# Altium schematic sheet Sheet1.SchDoc
size A4
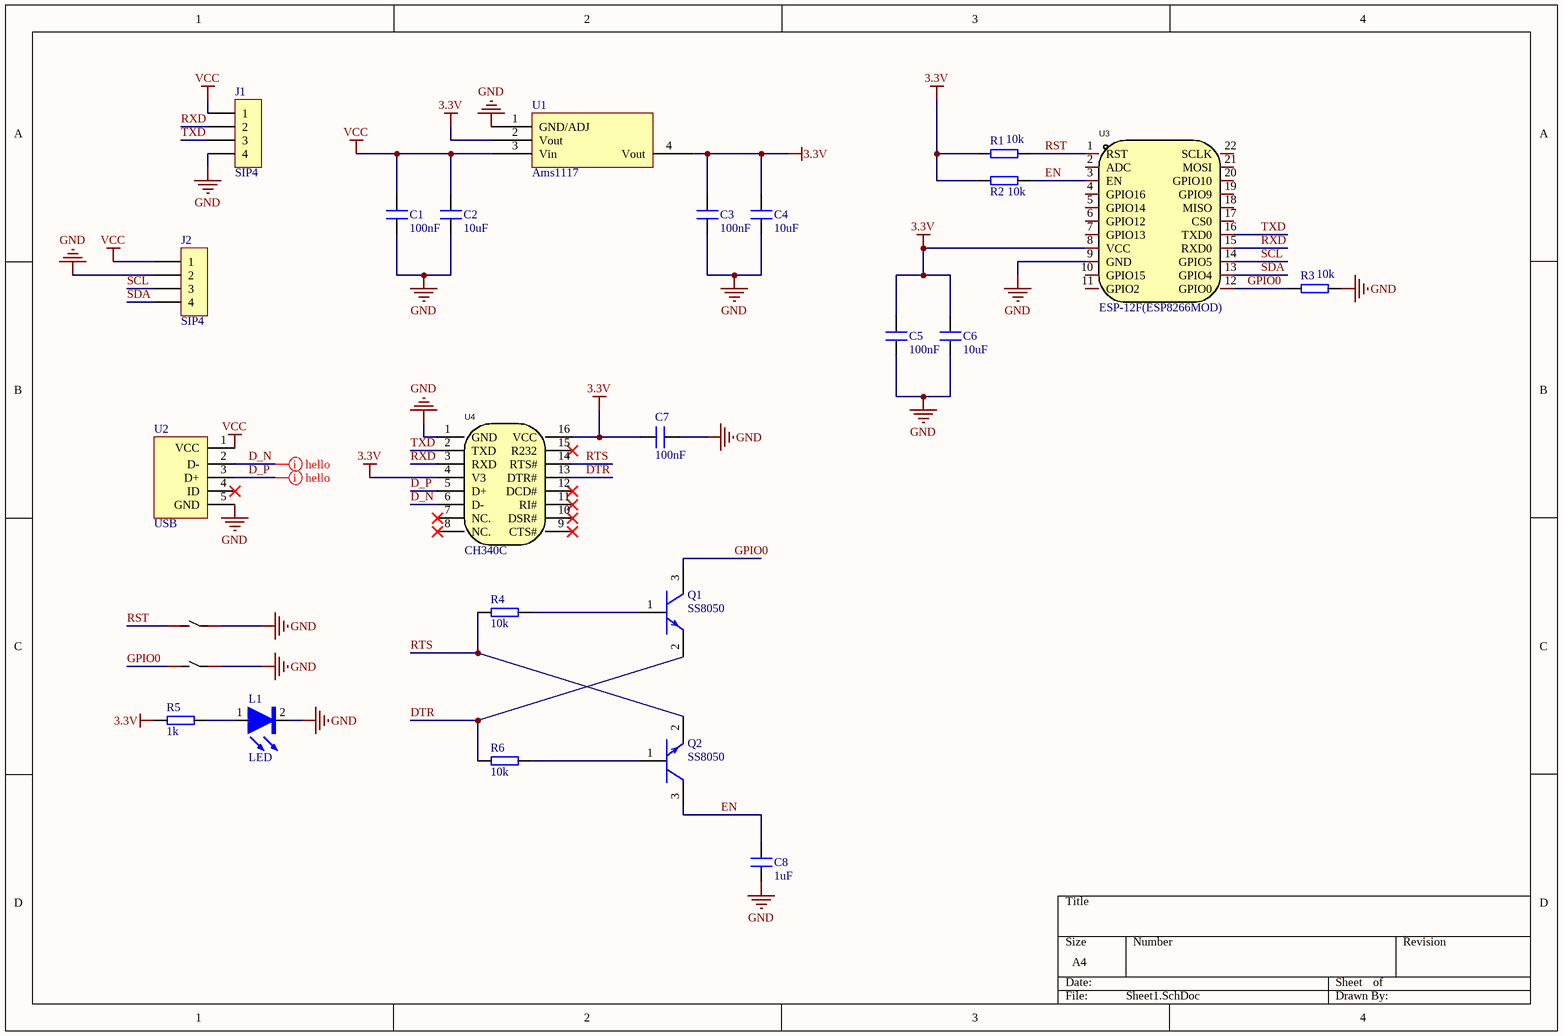
[diagram p0: Sheet1.SchDoc]

## Parts
C1  100nF  [0805C]
C2  10uF  [0805C]
C3  100nF  [0805C]
C4  10uF  [0805C]
C5  100nF  [0805C]
C6  10uF  [0805C]
C7  100nF  [0805C]
C8  1uF  [0805C]
J1  SIP4  [XH2.54-WS-4P]
J2  SIP4  [SIP_4P-P2.54-V-F]
L1  LED  [LED0603-R-RD_GREEN]
Q1  SS8050  [SOT-23-3_L2.9-W1.3-P1.90-LS2.4-BR]
Q2  SS8050  [SOT-23-3_L2.9-W1.3-P1.90-LS2.4-BR]
R1  10k  [0805R]
R2  10k  [0805R]
R3  10k  [0805R]
R4  10k  [0805R]
R5  1k  [0805R]
R6  10k  [0805R]
SW1  TS342A2P 250gf-WZ 021_C2987973  [SW-SMD_L4.0-W2.9-LS5.0]  (value not drawn)
SW2  TS342A2P 250gf-WZ 021_C2987973  [SW-SMD_L4.0-W2.9-LS5.0]  (value not drawn)
U1  Ams1117  [SOT-223-4_L6.5-W3.5-P2.30-LS7.0-BR]
U2  USB  [USB-SMD_MINI-5PTP]
U3  ESP-12F(ESP8266MOD)  [ESP-12F_SMD]
U4  CH340C  [SOP16_L10.0-W3.9-P1.27-LS6.0-BL]

## Nets
3.3V: C3.2 C4.2 C5.2 C6.2 C7.1 R1.1 R2.1 R5.1 U1.2(Vout) U1.4(Vout) U3.8(VCC) U4.4(V3) U4.16(VCC)
GND: C1.1 C2.1 C3.1 C4.1 C5.1 C6.1 C7.2 C8.1 J1.4 J2.2 L1.2 R3.2 SW1.2 SW2.2 U1.1(GND/ADJ) U2.5(GND) U3.9(GND) U4.1(GND)
VCC: C1.2 C2.2 J1.1 J2.1 U1.3(Vin) U2.1(VCC)
D_N: U2.2(D-) U4.6(D-)
D_P: U2.3(D+) U4.5(D+)
DTR: Q1.2(E) R6.1 U4.13(DTR#)
EN: C8.2 Q2.3(C) R2.2 U3.3(EN)
GPIO0: Q1.3(C) R3.1 SW2.1 U3.12(GPIO0)
RST: R1.2 SW1.1 U3.1(RST)
RTS: Q2.2(E) R4.1 U4.14(RTS#)
RXD: J1.2 U3.15(RXD0) U4.3(RXD)
SCL: J2.3 U3.14(GPIO5)
SDA: J2.4 U3.13(GPIO4)
TXD: J1.3 U3.16(TXD0) U4.2(TXD)
NetL1_1: L1.1 R5.2
NetQ1_1: Q1.1(B) R4.2
NetQ2_1: Q2.1(B) R6.2

Not connected (* = marked no-connect by the designer): U2 4(ID)*; U3 2(ADC) 4(GPIO16) 5(GPIO14) 6(GPIO12) 7(GPIO13) 10(GPIO15) 11(GPIO2) 17(CS0) 18(MISO) 19(GPIO9) 20(GPIO10) 21(MOSI) 22(SCLK); U4 7(NC.)* 8(NC.)* 9(CTS#)* 10(DSR#)* 11(RI#)* 12(DCD#)* 15(R232)*

## Layout directives
differential pair: D_N, D_P

## Library data of the parts
C1-C8 = CAP: 电容
J1 J2 = SIP4: jointbar
R1-R6 = RES: 电阻
SW1 SW2 = SW: Manufacturer: SHOU HAN(首韩); Add into BOM: yes; Contact Current: 50mA; Voltage Rating (DC): 12V; Insulation Resistance: 100MΩ; Circuit: 单刀单掷; Actuator Style: 圆形按钮; Actuator/Cap Color: 黑色; Operating Force: 250gf@±50gf; Mechanical Life: 100000; Pin Style: SMD接片; Switch Length: 3.95mm; Switch Width: 2.9mm; Switch Height: 2mm; Strike Gundam: 否; Name: TS342A2P 250gf-WZ 021; Symbol: TS342A2P 250GF-WZ 021_C2987973; Device: TS342A2P 250gf-WZ 021_C2987973; LCSC Part Name: TS342A2P 250gf-WZ 021; Supplier Part: C2987973; Manufacturer Part: TS342A2P 250gf-WZ 021; Supplier Footprint: SMD; JLCPCB Part Class: Extended Part; Datasheet: https://atta.szlcsc.com/upload/public/pdf/source/20211019/B0840D9D2EDA6B165E59EB2CD177CDC8.pdf; Supplier: LCSC; Convert to PCB: yes; Mounting Style: 立贴; Operating Temperature: -20℃~+70℃
U3 = ESP-12F(ESP8266MOD): Manufacturer: Ai-Thinker(安信可); Name: 2.4GHz; Add into BOM: yes; Value: 2.4GHz; Output Power: 16dBm; Support Interface: GPIO；UART；IIC；PWM；SPI；ADC; Antenna Type: PCB 板载天线; Wireless Standard: 802.11b/g/n; Operating Voltage: 3.3V; Receive  Current: 120mA; Send  Current: 170mA; Sensitivity: -90dBm; Symbol: ESP-12F(ESP8266MOD); Device: ESP-12F(ESP8266MOD); LCSC Part Name: ESP-12F(ESP8266MOD); Supplier Part: C82891; Manufacturer Part: ESP-12F(ESP8266MOD); Supplier Footprint: WIFI Module; JLCPCB Part Class: Extended Part; Datasheet: https://atta.szlcsc.com/upload/public/pdf/source/20210219/C82891_ABD84A460F4F056A2757267CCCA4B508.pdf; Supplier: LCSC; Convert to PCB: yes; Core Processor: ESP8266; Operating Temperature: -40℃~+85℃
U4 = CH340C: Manufacturer: WCH(南京沁恒); Add into BOM: yes; Applications Function: Transceiver; Protocol: USB 2.0; Data Rate: 2Mbps; Supply Voltage: 3.3V；5V; Name: CH340C; Symbol: CH340C; Device: CH340C; LCSC Part Name: CH340C; Supplier Part: C84681; Manufacturer Part: CH340C; Supplier Footprint: SOP-16; JLCPCB Part Class: Extended Part; Datasheet: https://atta.szlcsc.com/upload/public/pdf/source/20200819/C84681_ADBED554CE321879DBD6B1D06488689C.pdf; Supplier: LCSC; Convert to PCB: yes